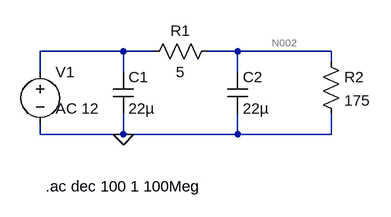
[diagram p0: schematic voltage_input_filter.asc]
voltage_input_filter.asc, the LTspice schematic file:
Version 4.1
SHEET 1 880 680
WIRE 224 80 96 80
WIRE 272 80 224 80
WIRE 400 80 352 80
WIRE 544 80 400 80
WIRE 544 96 544 80
WIRE 96 112 96 80
WIRE 224 112 224 80
WIRE 400 112 400 80
WIRE 96 208 96 192
WIRE 224 208 224 176
WIRE 224 208 96 208
WIRE 400 208 400 176
WIRE 400 208 224 208
WIRE 544 208 544 176
WIRE 544 208 400 208
FLAG 224 208 0
SYMBOL voltage 96 96 R0
WINDOW 123 24 72 Left 2
WINDOW 39 0 0 Left 0
WINDOW 3 24 44 Left 2
SYMATTR Value2 AC 12
SYMATTR InstName V1
SYMATTR Value ""
SYMBOL cap 208 112 R0
SYMATTR InstName C1
SYMATTR Value 22µ
SYMBOL cap 384 112 R0
SYMATTR InstName C2
SYMATTR Value 22µ
SYMBOL res 368 64 R90
WINDOW 0 0 56 VBottom 2
WINDOW 3 32 56 VTop 2
SYMATTR InstName R1
SYMATTR Value 5
SYMBOL res 528 80 R0
SYMATTR InstName R2
SYMATTR Value 175
TEXT 104 288 Left 2 !.ac dec 100 1 100Meg

The netlist it stands for:
* voltage_input_filter.asc
V1 N001 0 AC 12
C1 N001 0 22µ
C2 N002 0 22µ
R1 N002 N001 5
R2 N002 0 175
.ac dec 100 1 100Meg
.backanno
.end

* Results of the author's LTspice run, read from the files saved beside the schematic
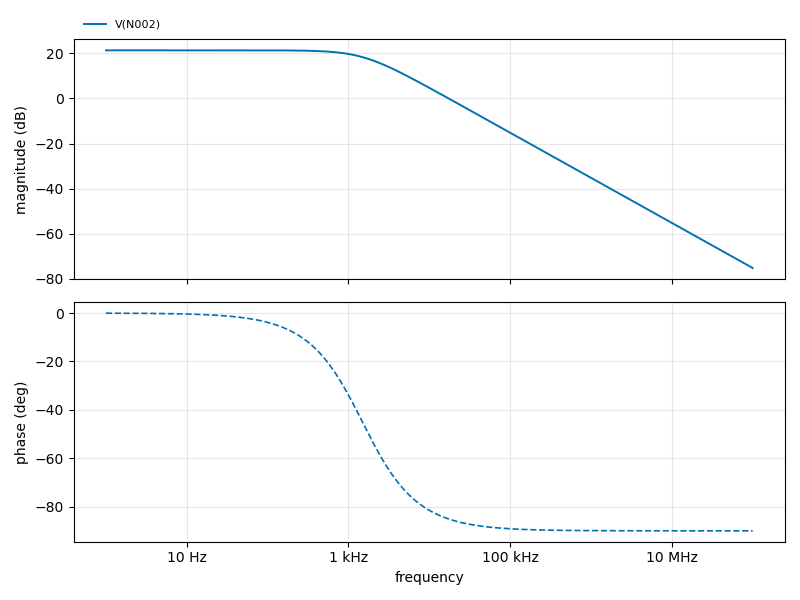
[diagram p1: AC Analysis of voltage_input_filter.asc, plotted from the saved traces]
* AC Analysis, 1 run:
*   V(N002): 21.34 dB at 1 Hz, -75.21 dB at 100 MHz, peak 21.34 dB at 1 Hz, 3 dB below the peak at 1.488 kHz